# Altium project Ethylene Sensor Rev2.PrjPcb
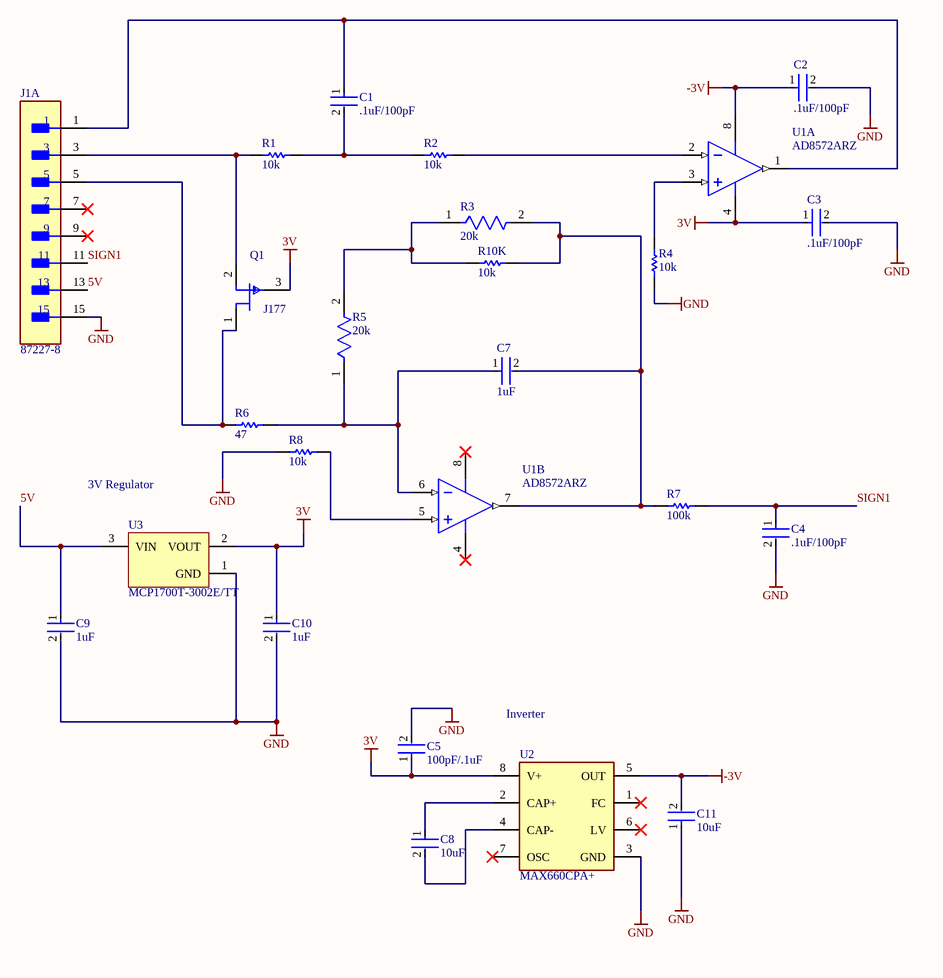
[diagram p0: Ethylene Sensor Rev2.SchDoc]
1 sheet, 24 parts. Net scope: global (net labels, ports and power ports of the same name join across sheets).
Board file: Ethylene Sensor Rev2.PcbDoc

## Sheet Ethylene Sensor Rev2.SchDoc
size D; SheetNumber: 1; SheetTotal: 1

### Parts
C1  .1uF/100pF  [FP-RCE0K1-MFG]
C2  .1uF/100pF  [FP-RCE0K1-MFG]
C3  .1uF/100pF  [FP-RCE0K1-MFG]
C4  .1uF/100pF  [FP-RCE0K1-MFG]
C5  100pF/.1uF  [FP-RCE0DB-MFG]
C7  1uF  [FP-K105Z20Y5VF5TL2-MFG]
C8  10uF  [FP-RCE3M1-MFG]
C9  1uF  [FP-K105Z20Y5VF5TL2-MFG]
C10  1uF  [FP-K105Z20Y5VF5TL2-MFG]
C11  10uF  [FP-RCE3M1-MFG]
J1  87227-8  [FP-87227-8-MFG]  (part A of 2)
Q1  J177  [FP-318-08-IPC_C]
R1  10k  [OMTE-RES7X2.5-2]
R2  10k  [OMTE-RES7X2.5-2]
R3  20k  [FP-S102K-MFG]
R4  10k  [OMTE-RES7X2.5-2]
R5  20k  [FP-S102K-MFG]
R6  47  [RESC1609X50X30LL10T20]
R7  100k  [RESA60-630X240]
R8  10k  [OMTE-RES7X2.5-2]
R10K  10k  [OMTE-RES7X2.5-2]
U1  AD8572ARZ  [ADI-R-8_L]  (parts A,B of 2)
U2  MAX660CPA+  [FP-P8-2-MFG]
U3  MCP1700T-3002E/TT  [SOT-23-TT3_L]

### Nets
3V: C3.1 C5.1 C10.1 Q1.3(G) U1.4(-V) U2.8(V+) U3.2(VOUT)
-3V: C2.1 C11.2 U1.8(+V) U2.5(OUT)
GND: C2.2 C3.2 C4.2 C5.2 C9.2 C10.2 C11.1 J1.15 R4.1 R8.1 U2.3(GND) U3.1(GND)
5V: C9.1 J1.13 U3.3(VIN)
SIGN1: C4.1 J1.11 R7.2
NetC1_1: C1.1 J1.1 U1.1(OUT_A)
NetC1_2: C1.2 R1.2 R2.1
NetC7_1: C7.1 R5.1 R6.2 U1.6(-IN_B)
NetC7_2: C7.2 R3.2 R7.1 R10K.2 U1.7(OUT_B)
NetC8_1: C8.1 U2.2(CAP+)
NetC8_2: C8.2 U2.4(CAP-)
NetJ1_3: J1.3 Q1.2(S) R1.1
NetJ1_5: J1.5 Q1.1(D) R6.1
NetR2_2: R2.2 U1.2(-IN_A)
NetR3_1: R3.1 R5.2 R10K.1
NetR4_2: R4.2 U1.3(+IN_A)
NetR8_2: R8.2 U1.5(+IN_B)

Not connected (* = marked no-connect by the designer): J1 7* 9*; U2 1(FC)* 6(LV)* 7(OSC)*

### Notes on the sheet
- 3V Regulator
- Inverter

### Library data of the parts
C1-C4 = CMP-06035-023108-1: Cap Ceramic 100pF 100V C0G ±5% Radial 5mm +125°C Automotive Bulk; Lead/Base Style: Formed Leads; Lead Diameter: 0.5mm; Termination: Radial; Packaging: Tape and Reel; Lead Pitch: 0.197inch; Capacitance: 100pF; Height - Seated (Max): 0.138inch; Width: 0.098inch; Max Operating Temperature: 125°C; Resistor Type: Ceramic; Length: 0.142inch; Ratings: AEC-Q200; Mount: Through Hole; Voltage Rating (DC): 100V; Dielectric: C0G; Voltage Rating: 100V; Case/Package: Radial; Min Operating Temperature: -55°C; Tolerance: 5%; Package Quantity: 2000; Height: 3.5mm
C5 = CMP-06035-022164-1: Cap Ceramic 100pF 100V C0G ±5% Radial 2.5mm +125°C Ammo Pack; Lead Diameter: 0.5mm; Lead/Base Style: Straight; Resistor Type: Ceramic; Termination: Radial; Voltage Rating: 100V; Height: 3.5mm; Min Operating Temperature: -55°C; Packaging: Tape and Reel; Lead Pitch: 0.098inch; Width: 0.098inch; Voltage Rating (DC): 100V; Tolerance: 5%; Capacitance: 100pF; Max Operating Temperature: 125°C; Dielectric: C0G; Height - Seated (Max): 0.138inch; Case/Package: Radial; Length: 0.142inch; Ratings: AEC-Q200; Mount: Through Hole; Package Quantity: 2000
C7 C9 C10 = CMP-02417-000003-1: CAP CER 1UF 50V Y5V RADIAL; Manufacturer Part Number: K105Z20Y5VF5TL2; Manufacturer: Vishay BC Components; Tolerance: -20+80%; Material: Ceramic; Capacitance: 1uF; Temperature Characteristic: Y5V; Mouser Description: Multilayer Ceramic Capacitors MLCC - Leaded 1uF 50volts +80/-20% Y5V 2.5mm LS; Lead Free: Yes; RoHS: TRUE; Voltage Rating: 50V; Device Class L1: Passive Components; Octopart: https://octopart.com/k105z20y5vf5tl2-vishay-39475252; Temperature Range Low: -30°C; Digikey Description: CAP CER 1UF 50V Y5V RADIAL; Device Class L2: Capacitors; Temperature: -30°C to +85°C; Package: K105Z20Y5VF5TL2; Temperature Range High: +85°C; ComponentLink2Description: Datasheet; Value: 1uF; Category: Cap; Height: 6.6mm; ComponentLink2URL: https://www.vishay.com/docs/45171/kseries.pdf; Device Class L3: Ceramic Capacitors; Automotive: No
C8 C11 = CMP-06035-005744-1: Cap Ceramic 10uF 25V X7R ±10% Radial 5mm +125°C Automotive Ammo Pack; Lead/Base Style: Formed Leads; Lead Diameter: 0.5mm; Length: 0.217inch; Package Quantity: 1500; Width: 0.157inch; Resistor Type: Ceramic; Height - Seated (Max): 0.197inch; Ratings: AEC-Q200; Lead Pitch: 0.197inch; Packaging: Tape and Reel; Tolerance: 10%; Voltage Rating (DC): 25V; Capacitance: 10uF; Termination: Radial; Mount: Through Hole; Voltage Rating: 25V; Min Operating Temperature: -55°C; Height: 5mm; Dielectric: X7R; Max Operating Temperature: 125°C; Case/Package: Radial
J1 = CMP-03369-000064-1: CONN HEADER VERT 16POS 2.54MM; Manufacturer: TE Connectivity; Conn Gender: Male; Conn Orientation: Straight; Current Rating: 3A; Number Of Contacts: 16; Mouser Description: Headers & Wire Housings UNSHRD VERT DUAL 16; Lead Free: Yes; Digikey Description: CONN HEADER VERT 16POS 2.54MM; Device Class L3: unset; Automotive: No; Height: 0.428inch; Temperature Range Low: -65°C; Device Class L1: Connectors; RoHS: TRUE; Pitch: 2.54mm; Package: 0; Manufacturer Part Number: 87227-8; Number Of Rows: 2; Footprint Url: https://www.te.com/commerce/DocumentDelivery/DDEController?Action=showdoc&DocId=Customer+Drawing%7F87227%7FH4%7Fpdf%7FEnglish%7FENG_CD_87227_H4.pdf%7F87227-8; ComponentLink2URL: https://www.te.com/usa-en/product-87227-8.datasheet.pdf; ComponentLink2Description: Datasheet; Temperature: -65°C to +105°C; Category: Conn; Temperature Range High: +105°C; Octopart: https://octopart.com/87227-8-te+connectivity-39407754; Device Class L2: Headers and Wire Housings; Contact Material: Gold,Nickel
Q1 = CMP-1062-00047-2: JFET P-CH 30V 0.225W SOT23; Element Configuration: Single; Voltage Rating (DC): -25V; Input Capacitance: 11pF; Current Rating: -20mA; Max Power Dissipation: 225mW; Continuous Drain Current (ID): 20mA; Gate to Source Voltage (Vgs): 25V; Drain to Source Resistance: 300R; Package Quantity: 1; REACH SVHC: No SVHC; Breakdown Voltage: 30V; Length: 3.04mm; Height: 1.01mm; Width: 1.4mm; Radiation Hardening: No; Min Operating Temperature: -55°C; Weight: 0.050717oz; Case/Package: SOT-23-3; Max Operating Temperature: 150°C; Halogen Free: Halogen Free; Contact Plating: Tin; Packaging: Tape and Reel; Lead Free: Lead Free; Power Dissipation: 225mW; Number of Pins: 3; Drain to Source Voltage (Vdss): 25V
R1 R2 R4 R8 R10K = CMP-2000-06865-1: Little Demon(R) Carbon Composition Molded OD Series, 250 V, 10 KOhm, +/-5%, -70 to 130 degC, 2-Pin THD, RoHS, Bulk; PartNumber: OD103JE; Manufacturer: Ohmite; Power Rating: 0.25W; Power (Watts): 0.25W,1/4W; Tolerance: ±5%; Online Catalog: OD,OF,OASeries,LittleDemon®; Catalog Drawings: OD,OF,OASeries; EDA / CAD Models: DownloadfromAcceleratedDesigns; Mounting Technology: ThroughHole; Datasheet Version: 06/2016; RoHS Information: LittleDemon"E"SeriesMaterialDeclaration; Number of Terminations: 2; Temperature Coefficient: -; Height: -; Resistance (Ohms): 10k; Composition: CarbonComposition; Package Description: 2-Pin THD Resistor, Body 7 x 2.5 mm, Lead Dia. 0.6 mm; Size / Dimension: 0.098"Diax0.276"L(2.50mmx7.00mm); Category: Resistors; Manufacturer URL: http://www.ohmite.com/; Features: PulseWithstanding; Family: ThroughHoleResistors; Supplier Device Package: Axial; Package / Case: Axial; Standard Package: 100; Package Reference: RES7X2.5; Operating Temperature: -; Series: LittleDemon®OD; Datasheet URL: http://www.ohmite.com/cat/res_od_of_oa.pdf; Packaging: Bulk
R3 R5 = CMP-10850-000015-1: RES 20K OHM 0.6W 0.01% RADIAL; Resistance: 20kR; Voltage Rating: 300V; Temperature Coefficient: 1ppm/°C; Power Rating: 600mW; RoHS Compliant: Yes; Resistor Type: Metal Foil; Tolerance: 0.01%; Mount: Through Hole; Case/Package: Radial; Resistance Tolerance: 0.01%
R6 = CMP-2000-03383-1: Manufacturer: Vishay Dale; Part Number: CRCW060347R0FKEA
R7 = CMP-1659-00073-1: Axial Resistor, 100 KOhm, +/- 1%, 0.25 W, -55 to 155 degC, 2-Pin THD, RoHS, Bulk; Voltage Rating: 250 V; Power Rating: 250 mW; Resistance: 475 Ohm; PackageDescription: 2-Pin Axial Lead, Dia 2.4 mm, Body Length 6.3 mm; PackageReference: MFR-25; Length: 0.248 inch; ComponentLink2Description: Datasheet; Packaging: Bulk; DatasheetVersion: Apr-13; Package Quantity: 200; Min Operating Temperature: -55 degC; ComponentLink2URL: http://www.yageo.com/documents/recent/Yageo%20LR_MFR_2013.pdf; RoHSCompliant: true; ComponentLink1URL: http://www.yageo.com/; Tolerance: 1%; Case\Package: Axial; Mount: Through Hole; ComponentLink1Description: Manufacturer URL; Max Operating Temperature: 155 degC
U1 = CMP-0384-00919-1: Double Channel Rail-to-Rail Operational Amplifier, 1.5 MHz BW, 400 mV/us SR, Industrial, 8-pin SOIC (R-8), Tube; Manufacturer: Analog Devices; Generic Part Number: AD8572; Amplifiers Per Package: 2; Iq/Amp: 975uA; Input Offset Voltage: 1uV; Small Signal Bandwidth: 1.5MHz; Input Bias Current: 10pA; V Span Min: 2.7V; V Span Max: 6V; PackageVersion: 060506-A; ComponentLink1Description: Manufacturer URL; Code_JEDEC: MS-012-AA; PackageReference: R-8; ComponentLink1URL: http://www.analog.com/en/index.html; Mounting Technology: Surface Mount; ComponentLink2Description: Datasheet; Slew Rate: 400mV/us; ComponentLink3Description: Package Specification; DatasheetVersion: Rev. E; ComponentLink2URL: http://www.analog.com/static/imported-files/data_sheets/AD8571_8572_8574.pdf; PartNumber: AD8572ARZ; PackageDescription: 8-Pin Standard Small Outline Package, Body 3.9 x 4.9 mm, Pitch 1.27 mm; ComponentLink3URL: http://www.analog.com/static/imported-files/packages/PKG_PDF/SOIC_Narrow%20(R)/R_8.pdf
U2 = CMP-05722-000022-1: IC REG CHARG PUMP INV 100MA 8DIP; Manufacturer: Maxim Integrated; Max Supply Voltage: 5.5V; Number Of Outputs: 1; Output Type: Other; Nominal Supply Current: 0.12-1mA; Standoff Height: 0.38mm; Switching Frequency: 10/80kHz; Output Voltage: -5.5/+11V; Negative Voltage Available: true; Min Supply Voltage: 1.5V; Max Power Dissipation: 727mW; Switching Topology: Charge Pump; ComponentLink2Description: Datasheet; Octopart: https://octopart.com/max660cpa%2B-maxim+integrated-39427913; Height: 4.572mm; Temperature Range Low: 0°C; Manufacturer Part Number: MAX660CPA+; Temperature: 0°C to +70°C; Digikey Description: IC REG CHARG PUMP INV 100MA 8DIP; Device Class L3: Voltage Regulators - Switching; Mouser Description: Voltage Regulators - Switching Regulators CMOS Monolithic Voltage Converter; Device Class L1: Integrated Circuits (ICs); RoHS: TRUE; Automotive: No; Package: P8-2; Device Class L2: Power Management ICs; Footprint Url: https://pdfserv.maximintegrated.com/package_dwgs/21-0043.PDF; Output Current: 100mA; Lead Free: Yes; Category: IC; ComponentLink2URL: https://datasheets.maximintegrated.com/en/ds/MAX660.pdf; Temperature Range High: +70°C
U3 = CMP-0136-00788-1: Low Quiescent Current LDO, 3-Pin SOT-23, Extended Temperature, Tape and Reel; Code_IPC: SOT23-3; DatasheetVersion: revB, Feb-2007; PackageDescription: 3-Lead Plastic Small Outline Transistor (TT) [SOT-23]; PackageVersion: revBB, Aug-2009; PackageReference: SOT-23-TT3